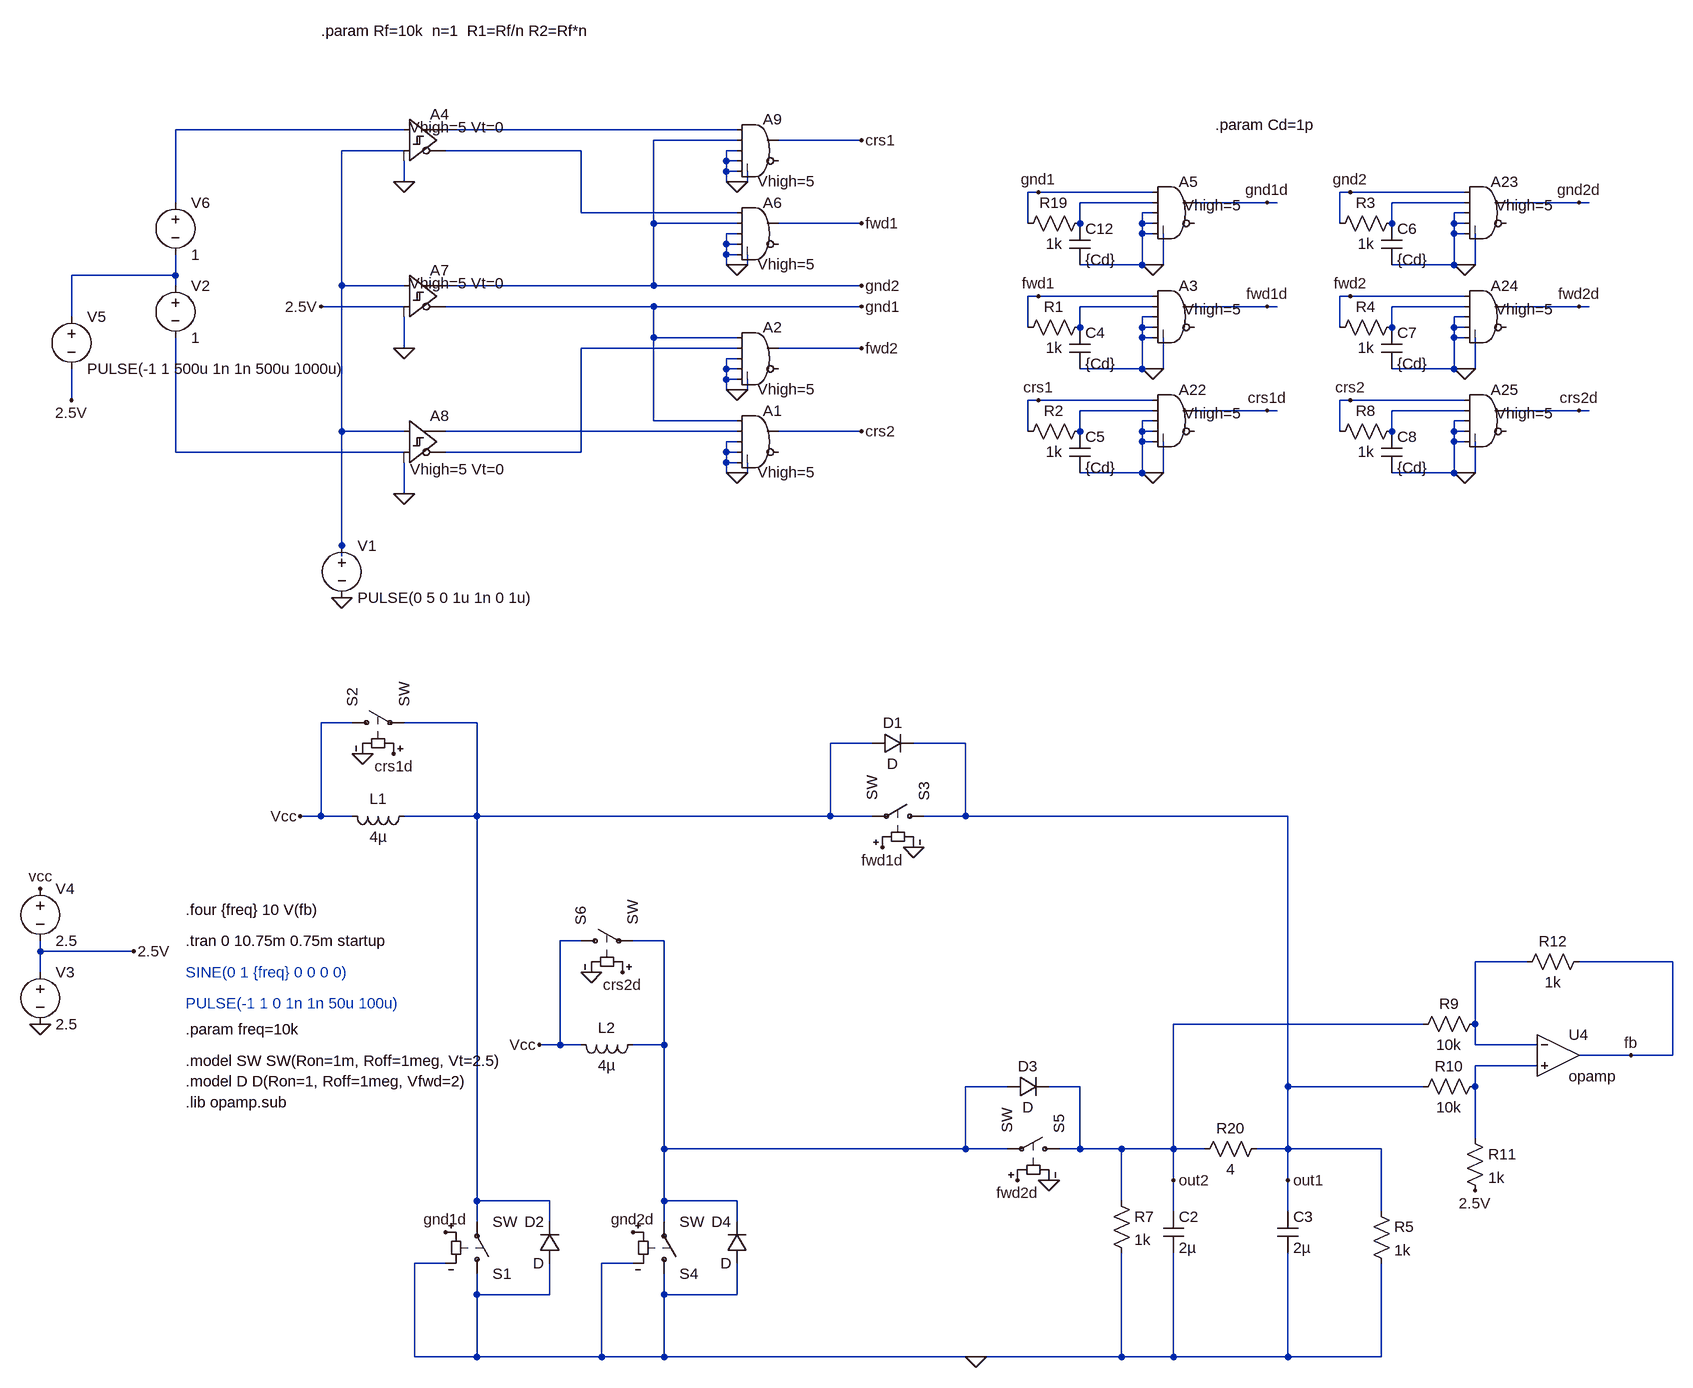
[diagram p0: schematic pwmFixedGnd.asc]
pwmFixedGnd.asc, the LTspice schematic file:
Version 4
SHEET 1 4100 980
WIRE 2144 -1232 1792 -1232
WIRE 2656 -1232 2208 -1232
WIRE 2656 -1216 2528 -1216
WIRE 2848 -1216 2720 -1216
WIRE 2144 -1200 2048 -1200
WIRE 2416 -1200 2208 -1200
WIRE 2656 -1200 2640 -1200
WIRE 2640 -1184 2640 -1200
WIRE 2656 -1184 2640 -1184
WIRE 2640 -1168 2640 -1184
WIRE 2656 -1168 2640 -1168
WIRE 2144 -1152 2144 -1184
WIRE 2640 -1152 2640 -1168
WIRE 2656 -1152 2640 -1152
WIRE 2672 -1152 2672 -1168
WIRE 2672 -1152 2656 -1152
WIRE 3120 -1136 3104 -1136
WIRE 3296 -1136 3120 -1136
WIRE 3600 -1136 3584 -1136
WIRE 3776 -1136 3600 -1136
WIRE 1792 -1120 1792 -1232
WIRE 3296 -1120 3184 -1120
WIRE 3472 -1120 3360 -1120
WIRE 3488 -1120 3472 -1120
WIRE 3776 -1120 3664 -1120
WIRE 3952 -1120 3840 -1120
WIRE 3968 -1120 3952 -1120
WIRE 2416 -1104 2416 -1200
WIRE 2656 -1104 2416 -1104
WIRE 3296 -1104 3280 -1104
WIRE 3776 -1104 3760 -1104
WIRE 2528 -1088 2528 -1216
WIRE 2656 -1088 2528 -1088
WIRE 2848 -1088 2720 -1088
WIRE 3104 -1088 3104 -1136
WIRE 3184 -1088 3184 -1120
WIRE 3280 -1088 3280 -1104
WIRE 3296 -1088 3280 -1088
WIRE 3584 -1088 3584 -1136
WIRE 3664 -1088 3664 -1120
WIRE 3760 -1088 3760 -1104
WIRE 3776 -1088 3760 -1088
WIRE 2656 -1072 2640 -1072
WIRE 3280 -1072 3280 -1088
WIRE 3296 -1072 3280 -1072
WIRE 3760 -1072 3760 -1088
WIRE 3776 -1072 3760 -1072
WIRE 2640 -1056 2640 -1072
WIRE 2656 -1056 2640 -1056
WIRE 2640 -1040 2640 -1056
WIRE 2656 -1040 2640 -1040
WIRE 2640 -1024 2640 -1040
WIRE 2656 -1024 2640 -1024
WIRE 2672 -1024 2672 -1040
WIRE 2672 -1024 2656 -1024
WIRE 3280 -1024 3280 -1072
WIRE 3280 -1024 3184 -1024
WIRE 3296 -1024 3280 -1024
WIRE 3312 -1024 3312 -1072
WIRE 3312 -1024 3296 -1024
WIRE 3760 -1024 3760 -1072
WIRE 3760 -1024 3664 -1024
WIRE 3776 -1024 3760 -1024
WIRE 3792 -1024 3792 -1072
WIRE 3792 -1024 3776 -1024
WIRE 1792 -1008 1792 -1040
WIRE 1792 -1008 1632 -1008
WIRE 1792 -992 1792 -1008
WIRE 2048 -992 2048 -1200
WIRE 2144 -992 2048 -992
WIRE 2528 -992 2528 -1088
WIRE 2528 -992 2208 -992
WIRE 2848 -992 2528 -992
WIRE 3120 -976 3104 -976
WIRE 3296 -976 3120 -976
WIRE 3600 -976 3584 -976
WIRE 3776 -976 3600 -976
WIRE 2144 -960 2016 -960
WIRE 2528 -960 2208 -960
WIRE 2848 -960 2528 -960
WIRE 3296 -960 3184 -960
WIRE 3472 -960 3360 -960
WIRE 3488 -960 3472 -960
WIRE 3776 -960 3664 -960
WIRE 3952 -960 3840 -960
WIRE 3968 -960 3952 -960
WIRE 1632 -944 1632 -1008
WIRE 3296 -944 3280 -944
WIRE 3776 -944 3760 -944
WIRE 3104 -928 3104 -976
WIRE 3184 -928 3184 -960
WIRE 3280 -928 3280 -944
WIRE 3296 -928 3280 -928
WIRE 3584 -928 3584 -976
WIRE 3664 -928 3664 -960
WIRE 3760 -928 3760 -944
WIRE 3776 -928 3760 -928
WIRE 2528 -912 2528 -960
WIRE 2656 -912 2528 -912
WIRE 3280 -912 3280 -928
WIRE 3296 -912 3280 -912
WIRE 3760 -912 3760 -928
WIRE 3776 -912 3760 -912
WIRE 2144 -896 2144 -944
WIRE 2656 -896 2416 -896
WIRE 2848 -896 2720 -896
WIRE 2656 -880 2640 -880
WIRE 2640 -864 2640 -880
WIRE 2656 -864 2640 -864
WIRE 3280 -864 3280 -912
WIRE 3280 -864 3184 -864
WIRE 3296 -864 3280 -864
WIRE 3312 -864 3312 -912
WIRE 3312 -864 3296 -864
WIRE 3760 -864 3760 -912
WIRE 3760 -864 3664 -864
WIRE 3776 -864 3760 -864
WIRE 3792 -864 3792 -912
WIRE 3792 -864 3776 -864
WIRE 2640 -848 2640 -864
WIRE 2656 -848 2640 -848
WIRE 2640 -832 2640 -848
WIRE 2656 -832 2640 -832
WIRE 2672 -832 2672 -848
WIRE 2672 -832 2656 -832
WIRE 1632 -816 1632 -864
WIRE 3120 -816 3104 -816
WIRE 3296 -816 3120 -816
WIRE 3600 -816 3584 -816
WIRE 3776 -816 3600 -816
WIRE 3296 -800 3184 -800
WIRE 3472 -800 3360 -800
WIRE 3488 -800 3472 -800
WIRE 3776 -800 3664 -800
WIRE 3952 -800 3840 -800
WIRE 3968 -800 3952 -800
WIRE 2528 -784 2528 -912
WIRE 2656 -784 2528 -784
WIRE 3296 -784 3280 -784
WIRE 3776 -784 3760 -784
WIRE 2048 -768 2048 -992
WIRE 2144 -768 2048 -768
WIRE 2656 -768 2208 -768
WIRE 2848 -768 2720 -768
WIRE 3104 -768 3104 -816
WIRE 3184 -768 3184 -800
WIRE 3280 -768 3280 -784
WIRE 3296 -768 3280 -768
WIRE 3584 -768 3584 -816
WIRE 3664 -768 3664 -800
WIRE 3760 -768 3760 -784
WIRE 3776 -768 3760 -768
WIRE 2656 -752 2640 -752
WIRE 3280 -752 3280 -768
WIRE 3296 -752 3280 -752
WIRE 3760 -752 3760 -768
WIRE 3776 -752 3760 -752
WIRE 1792 -736 1792 -912
WIRE 2144 -736 1792 -736
WIRE 2416 -736 2416 -896
WIRE 2416 -736 2208 -736
WIRE 2640 -736 2640 -752
WIRE 2656 -736 2640 -736
WIRE 2640 -720 2640 -736
WIRE 2656 -720 2640 -720
WIRE 2640 -704 2640 -720
WIRE 2656 -704 2640 -704
WIRE 2672 -704 2672 -720
WIRE 2672 -704 2656 -704
WIRE 3280 -704 3280 -752
WIRE 3280 -704 3184 -704
WIRE 3296 -704 3280 -704
WIRE 3312 -704 3312 -752
WIRE 3312 -704 3296 -704
WIRE 3760 -704 3760 -752
WIRE 3760 -704 3664 -704
WIRE 3776 -704 3760 -704
WIRE 3792 -704 3792 -752
WIRE 3792 -704 3776 -704
WIRE 2144 -672 2144 -720
WIRE 2048 -592 2048 -768
WIRE 2048 -576 2048 -592
WIRE 2064 -320 2016 -320
WIRE 2256 -320 2144 -320
WIRE 2864 -288 2800 -288
WIRE 3008 -288 2928 -288
WIRE 2016 -176 2016 -320
WIRE 2016 -176 1984 -176
WIRE 2064 -176 2016 -176
WIRE 2256 -176 2256 -320
WIRE 2256 -176 2144 -176
WIRE 2800 -176 2800 -288
WIRE 2800 -176 2256 -176
WIRE 2864 -176 2800 -176
WIRE 3008 -176 3008 -288
WIRE 3008 -176 2944 -176
WIRE 3504 -176 3008 -176
WIRE 2416 16 2384 16
WIRE 2544 16 2496 16
WIRE 1584 32 1584 16
WIRE 1728 32 1584 32
WIRE 3872 48 3792 48
WIRE 4096 48 3952 48
WIRE 1584 64 1584 32
WIRE 3712 144 3328 144
WIRE 3792 144 3792 48
WIRE 2384 176 2384 16
WIRE 2384 176 2352 176
WIRE 2416 176 2384 176
WIRE 2544 176 2544 16
WIRE 2544 176 2496 176
WIRE 3792 176 3792 144
WIRE 3888 176 3792 176
WIRE 4032 192 3952 192
WIRE 4096 192 4096 48
WIRE 4096 192 4032 192
WIRE 3888 208 3792 208
WIRE 3072 240 3008 240
WIRE 3184 240 3136 240
WIRE 3504 240 3504 -176
WIRE 3712 240 3504 240
WIRE 3792 240 3792 208
WIRE 3792 320 3792 240
WIRE 2544 336 2544 176
WIRE 3008 336 3008 240
WIRE 3008 336 2544 336
WIRE 3072 336 3008 336
WIRE 3184 336 3184 240
WIRE 3184 336 3152 336
WIRE 3248 336 3184 336
WIRE 3328 336 3328 144
WIRE 3328 336 3248 336
WIRE 3376 336 3328 336
WIRE 3504 336 3504 240
WIRE 3504 336 3456 336
WIRE 3648 336 3504 336
WIRE 3328 384 3328 336
WIRE 3504 384 3504 336
WIRE 2256 416 2256 -176
WIRE 2368 416 2256 416
WIRE 2544 416 2544 336
WIRE 2656 416 2544 416
WIRE 3248 416 3248 336
WIRE 3328 432 3328 384
WIRE 3504 432 3504 384
WIRE 3648 432 3648 336
WIRE 2256 448 2256 416
WIRE 2368 448 2368 416
WIRE 2544 448 2544 416
WIRE 2656 448 2656 416
WIRE 2208 512 2160 512
WIRE 2496 512 2448 512
WIRE 2256 560 2256 528
WIRE 2368 560 2368 512
WIRE 2368 560 2256 560
WIRE 2544 560 2544 528
WIRE 2656 560 2656 512
WIRE 2656 560 2544 560
WIRE 2160 656 2160 512
WIRE 2256 656 2256 560
WIRE 2256 656 2160 656
WIRE 2448 656 2448 512
WIRE 2448 656 2256 656
WIRE 2544 656 2544 560
WIRE 2544 656 2448 656
WIRE 3024 656 2544 656
WIRE 3248 656 3248 496
WIRE 3248 656 3024 656
WIRE 3328 656 3328 496
WIRE 3328 656 3248 656
WIRE 3504 656 3504 496
WIRE 3504 656 3328 656
WIRE 3648 656 3648 512
WIRE 3648 656 3504 656
FLAG 2048 -512 0
FLAG 1584 144 0
FLAG 1584 -64 vcc
FLAG 2144 -672 0
FLAG 2144 -896 0
FLAG 3024 656 0
FLAG 1984 -176 Vcc
FLAG 2352 176 Vcc
FLAG 2928 -128 0
FLAG 2432 64 0
FLAG 3136 384 0
FLAG 2080 -272 0
FLAG 3296 -1024 0
FLAG 2144 -1152 0
FLAG 1728 32 2.5V
FLAG 2848 -960 gnd1
FLAG 2848 -1088 fwd1
FLAG 2848 -1216 crs1
FLAG 2848 -992 gnd2
FLAG 2848 -896 fwd2
FLAG 2848 -768 crs2
FLAG 3296 -864 0
FLAG 3296 -704 0
FLAG 3776 -1024 0
FLAG 3776 -864 0
FLAG 3776 -704 0
FLAG 3120 -1136 gnd1
FLAG 3120 -976 fwd1
FLAG 3120 -816 crs1
FLAG 3600 -1136 gnd2
FLAG 3600 -976 fwd2
FLAG 3600 -816 crs2
FLAG 3472 -1120 gnd1d
FLAG 3472 -960 fwd1d
FLAG 3472 -800 crs1d
FLAG 3952 -1120 gnd2d
FLAG 3952 -960 fwd2d
FLAG 3952 -800 crs2d
FLAG 2208 464 gnd1d
FLAG 2496 464 gnd2d
FLAG 2880 -128 fwd1d
FLAG 2128 -272 crs1d
FLAG 3088 384 fwd2d
FLAG 2480 64 crs2d
FLAG 3792 400 2.5V
FLAG 4032 192 fb
FLAG 1632 -816 2.5V
FLAG 3504 384 out1
FLAG 3328 384 out2
FLAG 2656 -832 0
FLAG 2656 -1024 0
FLAG 2656 -704 0
FLAG 2656 -1152 0
FLAG 2016 -960 2.5V
SYMBOL voltage 2048 -608 R0
WINDOW 123 0 0 Left 2
WINDOW 39 0 0 Left 2
SYMATTR InstName V1
SYMATTR Value PULSE(0 5 0 1u 1n 0 1u)
SYMBOL voltage 1584 -80 R0
WINDOW 123 0 0 Left 2
WINDOW 39 0 0 Left 2
SYMATTR InstName V4
SYMATTR Value 2.5
SYMBOL ind 2160 -192 R90
WINDOW 0 5 56 VBottom 2
WINDOW 3 32 56 VTop 2
SYMATTR InstName L1
SYMATTR Value 4µ
SYMBOL cap 3312 432 R0
SYMATTR InstName C2
SYMATTR Value 2µ
SYMBOL cap 3488 432 R0
SYMATTR InstName C3
SYMATTR Value 2µ
SYMBOL sw 2256 544 M180
SYMATTR InstName S1
SYMBOL sw 2048 -320 R270
SYMATTR InstName S2
SYMBOL sw 2960 -176 M270
SYMATTR InstName S3
SYMBOL diode 2384 512 R180
WINDOW 0 24 64 Left 2
WINDOW 3 24 0 Left 2
SYMATTR InstName D2
SYMBOL sw 2544 544 M180
SYMATTR InstName S4
SYMBOL diode 2672 512 R180
WINDOW 0 24 64 Left 2
WINDOW 3 24 0 Left 2
SYMATTR InstName D4
SYMBOL sw 3168 336 M270
SYMATTR InstName S5
SYMBOL sw 2400 16 R270
SYMATTR InstName S6
SYMBOL ind 2512 160 R90
WINDOW 0 5 56 VBottom 2
WINDOW 3 32 56 VTop 2
SYMATTR InstName L2
SYMATTR Value 4µ
SYMBOL res 3632 416 R0
SYMATTR InstName R5
SYMATTR Value 1k
SYMBOL res 3232 400 R0
SYMATTR InstName R7
SYMATTR Value 1k
SYMBOL Digital\\and 3328 -1168 R0
WINDOW 3 16 52 Left 2
SYMATTR Value Vhigh=5
SYMATTR InstName A5
SYMBOL res 3200 -1104 R90
WINDOW 0 0 56 VBottom 2
WINDOW 3 32 56 VTop 2
SYMATTR InstName R19
SYMATTR Value 1k
SYMBOL cap 3168 -1088 R0
SYMATTR InstName C12
SYMATTR Value {Cd}
SYMBOL res 3472 320 R90
WINDOW 0 0 56 VBottom 2
WINDOW 3 32 56 VTop 2
SYMATTR InstName R20
SYMATTR Value 4
SYMBOL voltage 1584 48 R0
WINDOW 123 0 0 Left 2
WINDOW 39 0 0 Left 2
SYMATTR InstName V3
SYMATTR Value 2.5
SYMBOL diode 2864 -272 R270
WINDOW 0 32 32 VTop 2
WINDOW 3 0 32 VBottom 2
SYMATTR InstName D1
SYMBOL diode 3072 256 R270
WINDOW 0 32 32 VTop 2
WINDOW 3 0 32 VBottom 2
SYMATTR InstName D3
SYMBOL Digital\\and 3328 -1008 R0
WINDOW 3 16 52 Left 2
SYMATTR Value Vhigh=5
SYMATTR InstName A3
SYMBOL res 3200 -944 R90
WINDOW 0 0 56 VBottom 2
WINDOW 3 32 56 VTop 2
SYMATTR InstName R1
SYMATTR Value 1k
SYMBOL cap 3168 -928 R0
SYMATTR InstName C4
SYMATTR Value {Cd}
SYMBOL Digital\\and 3328 -848 R0
WINDOW 3 16 52 Left 2
SYMATTR Value Vhigh=5
SYMATTR InstName A22
SYMBOL res 3200 -784 R90
WINDOW 0 0 56 VBottom 2
WINDOW 3 32 56 VTop 2
SYMATTR InstName R2
SYMATTR Value 1k
SYMBOL cap 3168 -768 R0
SYMATTR InstName C5
SYMATTR Value {Cd}
SYMBOL Digital\\and 3808 -1168 R0
WINDOW 3 16 52 Left 2
SYMATTR Value Vhigh=5
SYMATTR InstName A23
SYMBOL res 3680 -1104 R90
WINDOW 0 0 56 VBottom 2
WINDOW 3 32 56 VTop 2
SYMATTR InstName R3
SYMATTR Value 1k
SYMBOL cap 3648 -1088 R0
SYMATTR InstName C6
SYMATTR Value {Cd}
SYMBOL Digital\\and 3808 -1008 R0
WINDOW 3 16 52 Left 2
SYMATTR Value Vhigh=5
SYMATTR InstName A24
SYMBOL res 3680 -944 R90
WINDOW 0 0 56 VBottom 2
WINDOW 3 32 56 VTop 2
SYMATTR InstName R4
SYMATTR Value 1k
SYMBOL cap 3648 -928 R0
SYMATTR InstName C7
SYMATTR Value {Cd}
SYMBOL Digital\\and 3808 -848 R0
WINDOW 3 16 52 Left 2
SYMATTR Value Vhigh=5
SYMATTR InstName A25
SYMBOL res 3680 -784 R90
WINDOW 0 0 56 VBottom 2
WINDOW 3 32 56 VTop 2
SYMATTR InstName R8
SYMATTR Value 1k
SYMBOL cap 3648 -768 R0
SYMATTR InstName C8
SYMATTR Value {Cd}
SYMBOL Opamps\\opamp 3920 128 R0
SYMATTR InstName U4
SYMBOL res 3808 128 R90
WINDOW 0 0 56 VBottom 2
WINDOW 3 32 56 VTop 2
SYMATTR InstName R9
SYMATTR Value 10k
SYMBOL res 3808 224 R90
WINDOW 0 0 56 VBottom 2
WINDOW 3 32 56 VTop 2
SYMATTR InstName R10
SYMATTR Value 10k
SYMBOL res 3776 304 R0
SYMATTR InstName R11
SYMATTR Value 1k
SYMBOL res 3968 32 R90
WINDOW 0 0 56 VBottom 2
WINDOW 3 32 56 VTop 2
SYMATTR InstName R12
SYMATTR Value 1k
SYMBOL voltage 1632 -960 R0
WINDOW 123 0 0 Left 2
WINDOW 39 0 0 Left 2
SYMATTR InstName V5
SYMATTR Value PULSE(-1 1 500u 1n 1n 500u 1000u)
SYMBOL Digital\\and 2688 -944 R0
WINDOW 3 0 111 Left 2
SYMATTR Value Vhigh=5
SYMATTR InstName A2
SYMBOL Digital\\and 2688 -1136 R0
WINDOW 3 0 111 Left 2
SYMATTR Value Vhigh=5
SYMATTR InstName A6
SYMBOL Digital\\diffschmitt 2144 -1280 R0
WINDOW 3 8 44 Left 2
SYMATTR Value Vhigh=5 Vt=0
SYMATTR InstName A4
SYMBOL Digital\\diffschmitt 2144 -1040 R0
WINDOW 3 8 44 Left 2
SYMATTR Value Vhigh=5 Vt=0
SYMATTR InstName A7
SYMBOL Digital\\diffschmitt 2144 -816 R0
WINDOW 3 9 106 Left 2
SYMATTR Value Vhigh=5 Vt=0
SYMATTR InstName A8
SYMBOL Digital\\and 2688 -816 R0
WINDOW 3 0 111 Left 2
SYMATTR Value Vhigh=5
SYMATTR InstName A1
SYMBOL Digital\\and 2688 -1264 R0
WINDOW 3 0 111 Left 2
SYMATTR Value Vhigh=5
SYMATTR InstName A9
SYMBOL voltage 1792 -1136 R0
WINDOW 123 0 0 Left 2
WINDOW 39 0 0 Left 2
SYMATTR InstName V6
SYMATTR Value 1
SYMBOL voltage 1792 -1008 R0
WINDOW 123 0 0 Left 2
WINDOW 39 0 0 Left 2
SYMATTR InstName V2
SYMATTR Value 1
TEXT 1808 16 Left 2 !.tran 0 10.75m 0.75m startup
TEXT 1808 200 Left 2 !.model SW SW(Ron=1m, Roff=1meg, Vt=2.5)
TEXT 1808 232 Left 2 !.model D D(Ron=1, Roff=1meg, Vfwd=2)
TEXT 3392 -1240 Left 2 !.param Cd=1p
TEXT 1808 264 Left 2 !.lib opamp.sub
TEXT 1808 64 Left 2 ;SINE(0 1 {freq} 0 0 0 0)
TEXT 1808 112 Left 2 ;PULSE(-1 1 0 1n 1n 50u 100u)
TEXT 1808 -32 Left 2 !.four {freq} 10 V(fb)
TEXT 1808 152 Left 2 !.param freq=10k
TEXT 2016 -1384 Left 2 !.param Rf=10k  n=1  R1=Rf/n R2=Rf*n

The netlist it stands for:
* pwmFixedGnd.asc
V1 N003 0 PULSE(0 5 0 1u 1n 0 1u)
V4 vcc 2.5V 2.5
L1 N015 vcc 4µ
C2 out2 0 2µ
C3 out1 0 2µ
S1 0 N015 gnd1d 0 SW
S2 vcc N015 crs1d 0 SW
S3 out1 N015 fwd1d 0 SW
D2 0 N015 D
S4 0 N016 gnd2d 0 SW
D4 0 N016 D
S5 out2 N016 fwd2d 0 SW
S6 vcc N016 crs2d 0 SW
L2 N016 vcc 4µ
R5 out1 0 1k
R7 out2 0 1k
A5 gnd1 N005 0 0 0 0 gnd1d 0 AND Vhigh=5
R19 N005 gnd1 1k
C12 N005 0 {Cd}
R20 out1 out2 4
V3 2.5V 0 2.5
D1 N015 out1 D
D3 N016 out2 D
A3 fwd1 N008 0 0 0 0 fwd1d 0 AND Vhigh=5
R1 N008 fwd1 1k
C4 N008 0 {Cd}
A22 crs1 N011 0 0 0 0 crs1d 0 AND Vhigh=5
R2 N011 crs1 1k
C5 N011 0 {Cd}
A23 gnd2 N006 0 0 0 0 gnd2d 0 AND Vhigh=5
R3 N006 gnd2 1k
C6 N006 0 {Cd}
A24 fwd2 N009 0 0 0 0 fwd2d 0 AND Vhigh=5
R4 N009 fwd2 1k
C7 N009 0 {Cd}
A25 crs2 N012 0 0 0 0 crs2d 0 AND Vhigh=5
R8 N012 crs2 1k
C8 N012 0 {Cd}
XU4 N017 N018 fb opamp Aol=100K GBW=10Meg  ; pins invin noninvin out
R9 N017 out2 10k
R10 N018 out1 10k
R11 N018 2.5V 1k
R12 fb N017 1k
V5 N007 2.5V PULSE(-1 1 500u 1n 1n 500u 1000u)
A2 gnd1 N010 0 0 0 0 fwd2 0 AND Vhigh=5
A6 N004 gnd2 0 0 0 0 fwd1 0 AND Vhigh=5
A4 N001 N003 0 0 0 N004 N002 0 SCHMITT Vhigh=5 Vt=0
A7 N003 2.5V 0 0 0 gnd1 gnd2 0 SCHMITT Vhigh=5 Vt=0
A8 N003 N014 0 0 0 N010 N013 0 SCHMITT Vhigh=5 Vt=0
A1 gnd1 N013 0 0 0 0 crs2 0 AND Vhigh=5
A9 N002 gnd2 0 0 0 0 crs1 0 AND Vhigh=5
V6 N001 N007 1
V2 N007 N014 1
.model D D
.lib standard.dio
.tran 0 10.75m 0.75m startup
.model SW SW(Ron=1m, Roff=1meg, Vt=2.5)
.model D D(Ron=1, Roff=1meg, Vfwd=2)
.param Cd=1p
.lib opamp.sub
* SINE(0 1 {freq} 0 0 0 0)
* PULSE(-1 1 0 1n 1n 50u 100u)
.four {freq} 10 V(fb)
.param freq=10k
.param Rf=10k  n=1  R1=Rf/n R2=Rf*n
.backanno
.end